# Altium schematic sheet Rectifier Stage.SchDoc: Rectifier Stage
size A4; Date: 28.08.2010; ApprovedBy: V.Gyurov; CheckedBy: V.Gyurov; Author: V.Gyurov; CompanyName: V.Gyurov; DrawnBy: V.Gyurov; Engineer: V.Gyurov; DocumentNumber: 7; Revision: 00; SheetNumber: 7; SheetTotal: 7; VersionControl_RevNumber: V1.00 R.00; CurrentDate: 28.08.2010; DocumentName: Rectifier Stage
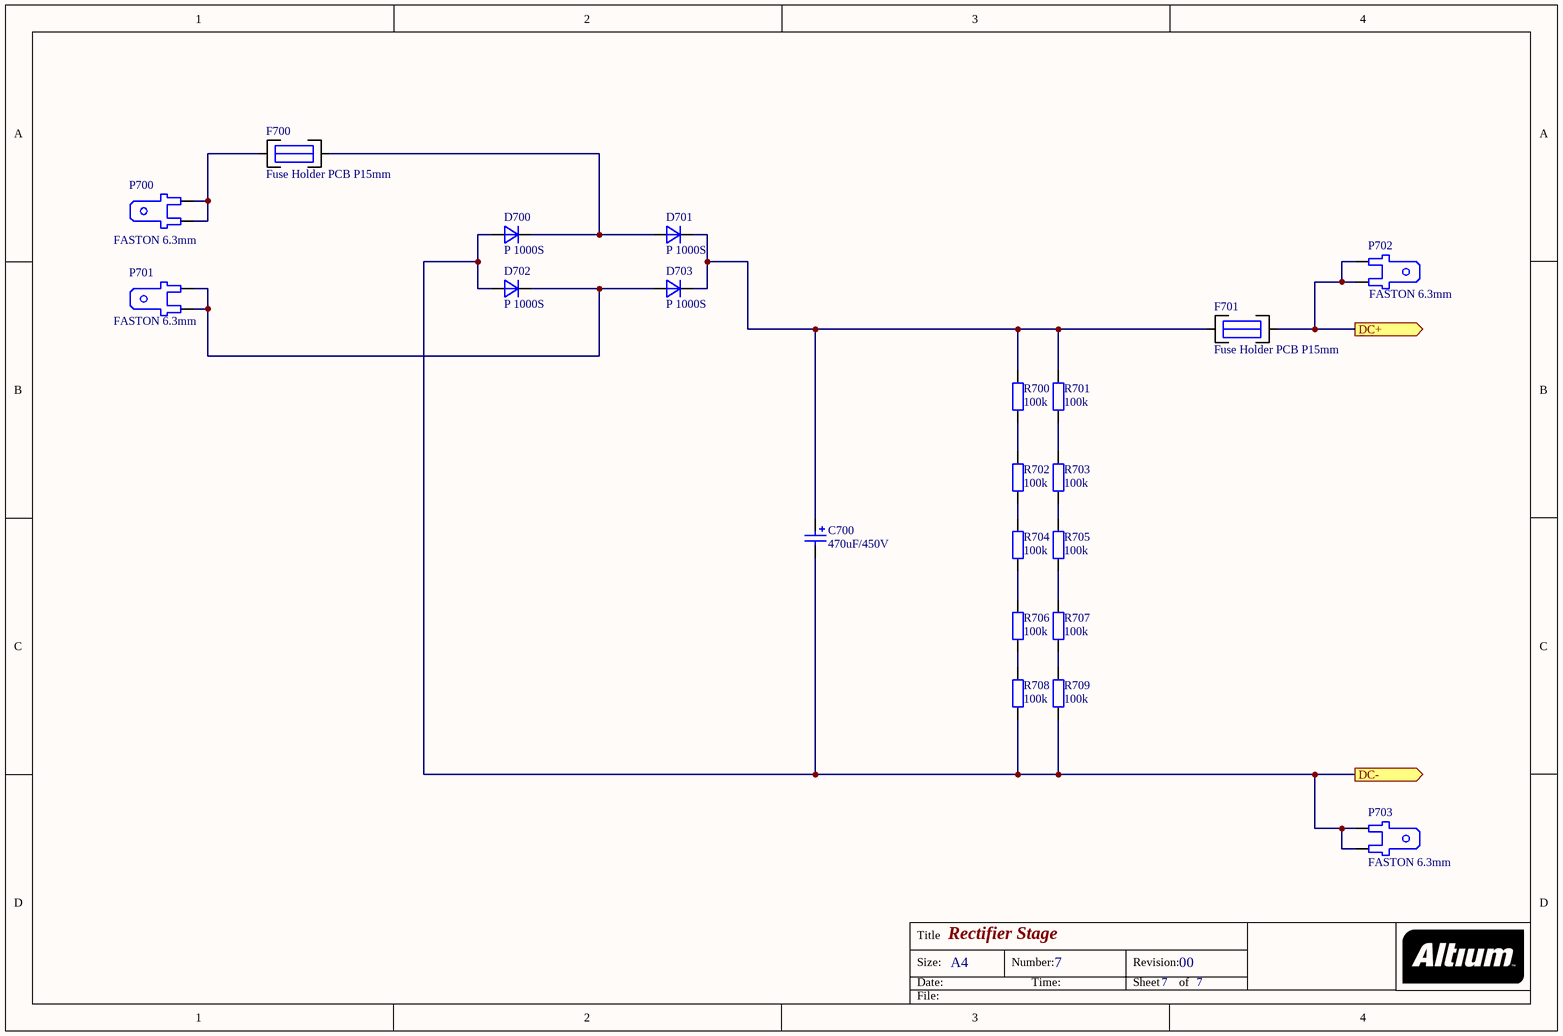
[diagram p0: Rectifier Stage.SchDoc]

## Parts
C700  value 470uF/450V  [CAPR 52X35]  (hidden comment: Cap)
D700  P 1000S  [P 1000 S]
D701  P 1000S  [P 1000 S]
D702  P 1000S  [P 1000 S]
D703  P 1000S  [P 1000 S]
F700  Fuse Holder PCB P15mm  [Fuse Holder PCB P15mm]
F701  Fuse Holder PCB P15mm  [Fuse Holder PCB P15mm]
P700  FASTON 6.3MM  [FASTON 6.3mm]
P701  FASTON 6.3MM  [FASTON 6.3mm]
P702  FASTON 6.3MM  [FASTON 6.3mm]
P703  FASTON 6.3MM  [FASTON 6.3mm]
R700  value 100k  [1206_REFLOW]  (hidden comment: RES)
R701  value 100k  [1206_REFLOW]  (hidden comment: RES)
R702  value 100k  [1206_REFLOW]  (hidden comment: RES)
R703  value 100k  [1206_REFLOW]  (hidden comment: RES)
R704  value 100k  [1206_REFLOW]  (hidden comment: RES)
R705  value 100k  [1206_REFLOW]  (hidden comment: RES)
R706  value 100k  [1206_REFLOW]  (hidden comment: RES)
R707  value 100k  [1206_REFLOW]  (hidden comment: RES)
R708  value 100k  [1206_REFLOW]  (hidden comment: RES)
R709  value 100k  [1206_REFLOW]  (hidden comment: RES)

## Ports
DC+ (out), DC- (out)

## Nets
DC+: F701.2 P702.1 P702.2 ; port DC+
DC-: C700.2 D700.A D702.A P703.1 P703.2 R708.2 R709.2 ; port DC-
NetC700_1: C700.1 D701.K D703.K F701.1 R700.1 R701.1
NetD700_K: D700.K D701.A F700.2
NetD702_K: D702.K D703.A P701.1 P701.2
NetF700_1: F700.1 P700.1 P700.2
NetR700_2: R700.2 R702.1
NetR701_2: R701.2 R703.1
NetR702_2: R702.2 R704.1
NetR703_2: R703.2 R705.1
NetR704_2: R704.2 R706.1
NetR705_2: R705.2 R707.1
NetR706_2: R706.2 R708.1
NetR707_2: R707.2 R709.1

## Notes on the sheet
- Title
- Size:
- Date:
- A4
- Number:
- Time:
- Revision:
- Sheet
- of
- File:

## Library data of the parts
C700 = Cap pol
D700-D703 = P 1000S: Description: Standard silicon rectifier  diode; Value: P 1000S
R700-R709 = RES 1
F700 F701 = Fuse Holder PCB P15mm: Value: Fuse Holder PCB P15mm
P700-P703 = FASTON 6.3MM: Value: FASTON 6.3mm